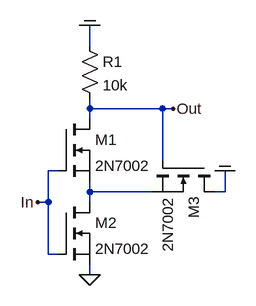
[diagram p0: schematic nm_schmitt_inverter.asc]
nm_schmitt_inverter.asc, the LTspice schematic file:
Version 4
SHEET 1 916 680
WIRE 208 -384 208 -416
WIRE 208 -288 208 -304
WIRE 320 -288 208 -288
WIRE 336 -288 320 -288
WIRE 208 -272 208 -288
WIRE 320 -208 320 -288
WIRE 160 -192 144 -192
WIRE 208 -160 208 -176
WIRE 304 -160 208 -160
WIRE 416 -160 416 -192
WIRE 416 -160 400 -160
WIRE 144 -144 144 -192
WIRE 144 -144 128 -144
WIRE 208 -144 208 -160
WIRE 144 -64 144 -144
WIRE 160 -64 144 -64
WIRE 208 -32 208 -48
FLAG 208 -32 0
FLAG 128 -144 In
FLAG 336 -288 Out
FLAG 416 -192 COM
FLAG 208 -416 COM
SYMBOL nmos 160 -272 R0
SYMATTR InstName M1
SYMATTR Value 2N7002
SYMBOL res 192 -400 R0
SYMATTR InstName R1
SYMATTR Value 10k
SYMBOL nmos 160 -144 R0
SYMATTR InstName M2
SYMATTR Value 2N7002
SYMBOL nmos 400 -208 R90
SYMATTR InstName M3
SYMATTR Value 2N7002

The netlist it stands for:
* nm_schmitt_inverter.asc
M1 Out In N001 N001 2N7002
R1 COM Out 10k
M2 N001 In 0 0 2N7002
M3 COM Out N001 N001 2N7002
.model NMOS NMOS
.model PMOS PMOS
.lib standard.mos
.backanno
.end